# EAGLE schematic room_sensors (EAGLE 6.4)

## Sheet 1 of 6
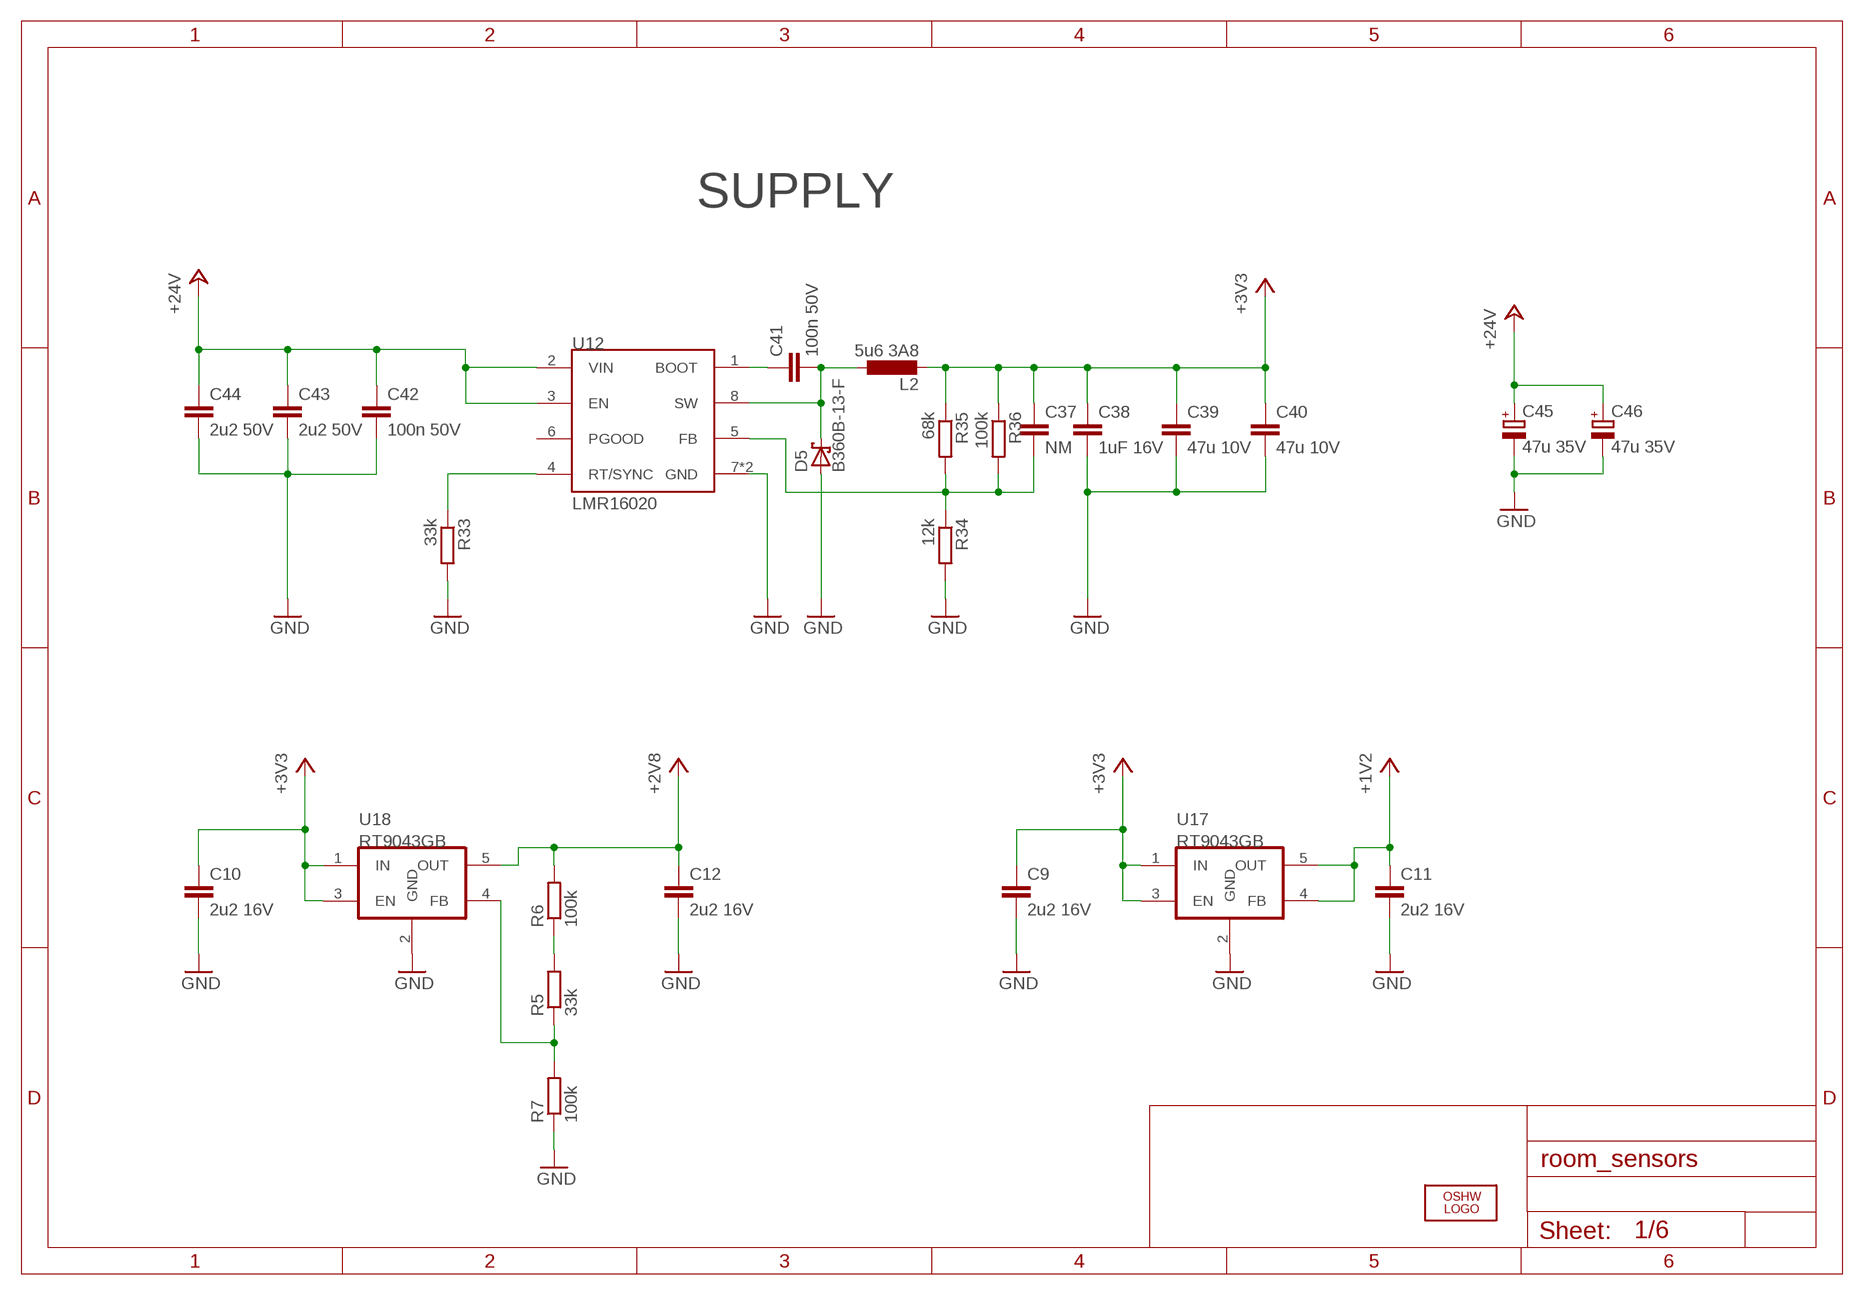
[diagram p0: schematic, sheet 1]

### Parts
C9  2u2 16V  C-EUC1206  [C1206]
C10  2u2 16V  C-EUC1206  [C1206]
C11  2u2 16V  C-EUC1206  [C1206]
C12  2u2 16V  C-EUC1206  [C1206]
C37  NM  C-EUC0805  [C0805]
C38  1uF 16V  C-EUC0805  [C0805]
C39  47u 10V  C-EUC1210  [C1210]
C40  47u 10V  C-EUC1210  [C1210]
C41  100n 50V  C-EUC1206  [C1206]
C42  100n 50V  C-EUC1206  [C1206]
C43  2u2 50V  C-EUC1206  [C1206]
C44  2u2 50V  C-EUC1206  [C1206]
C45  47u 35V  CPOL-EUUD-5X5,8  [UD-5X5,8_NICHICON]
C46  47u 35V  CPOL-EUUD-5X5,8  [UD-5X5,8_NICHICON]
D5  B360B-13-F  MBRS130LT3  [SMB]
L2  5u6 3A8  SLF10145T-150M2R2-PF  [SLF10145T-150M2R2-PF]
LOGO1  OSHW_LOGO_FILLX0350-NT  [OSHW_FILLX350_NOTEXT]
R5  33k  R-EU_R1206  [R1206]
R6  100k  R-EU_R1206  [R1206]
R7  100k  R-EU_R1206  [R1206]
R33  33k  R-EU_R1206  [R1206]
R34  12k  R-EU_R1206  [R1206]
R35  68k  R-EU_R1206  [R1206]
R36  100k  R-EU_R1206  [R1206]
U12  LMR16020  [SOIC127P600X170-8N]
U17  RT9043GB  [SOP95P275X110-5N]
U18  RT9043GB  [SOP95P275X110-5N]

### Nets
+1V2: C11.1 U17.4(FB) U17.5(OUT) ; also sheet 3
+2V8: C12.1 R6.2 U18.5(OUT) ; also sheet 3
+3V3: C9.1 C10.1 C37.1 C38.1 C39.1 C40.1 L2.P$2 R35.1 R36.1 U17.1(IN) U17.3(EN) U18.1(IN) U18.3(EN) ; also sheet 2,3,4,5,6
+24V: C42.1 C43.1 C44.1 C45.+ C46.+ U12.2(VIN) U12.3(EN) ; also sheet 2
ESP32_EN1: R5.1 R7.2 U18.4(FB)
GND: C9.2 C10.2 C11.2 C12.2 C38.2 C39.2 C40.2 C42.2 C43.2 C44.2 C45.- C46.- D5.A R7.1 R33.2 R34.2 U12.7(GND) U12.9(GND) U17.2(GND) U18.2(GND) ; also sheet 2,3,4,5,6
N$4: R5.2 R6.1
N$32: R33.1 U12.4(RT/SYNC)
N$33: C37.2 R34.1 R35.2 R36.2 U12.5(FB)
N$34: C41.2 D5.C L2.P$1 U12.8(SW)
N$35: C41.1 U12.1(BOOT)
Unconnected: U12.6(PGOOD)

### Notes on the sheet
- SUPPLY

## Sheet 2 of 6
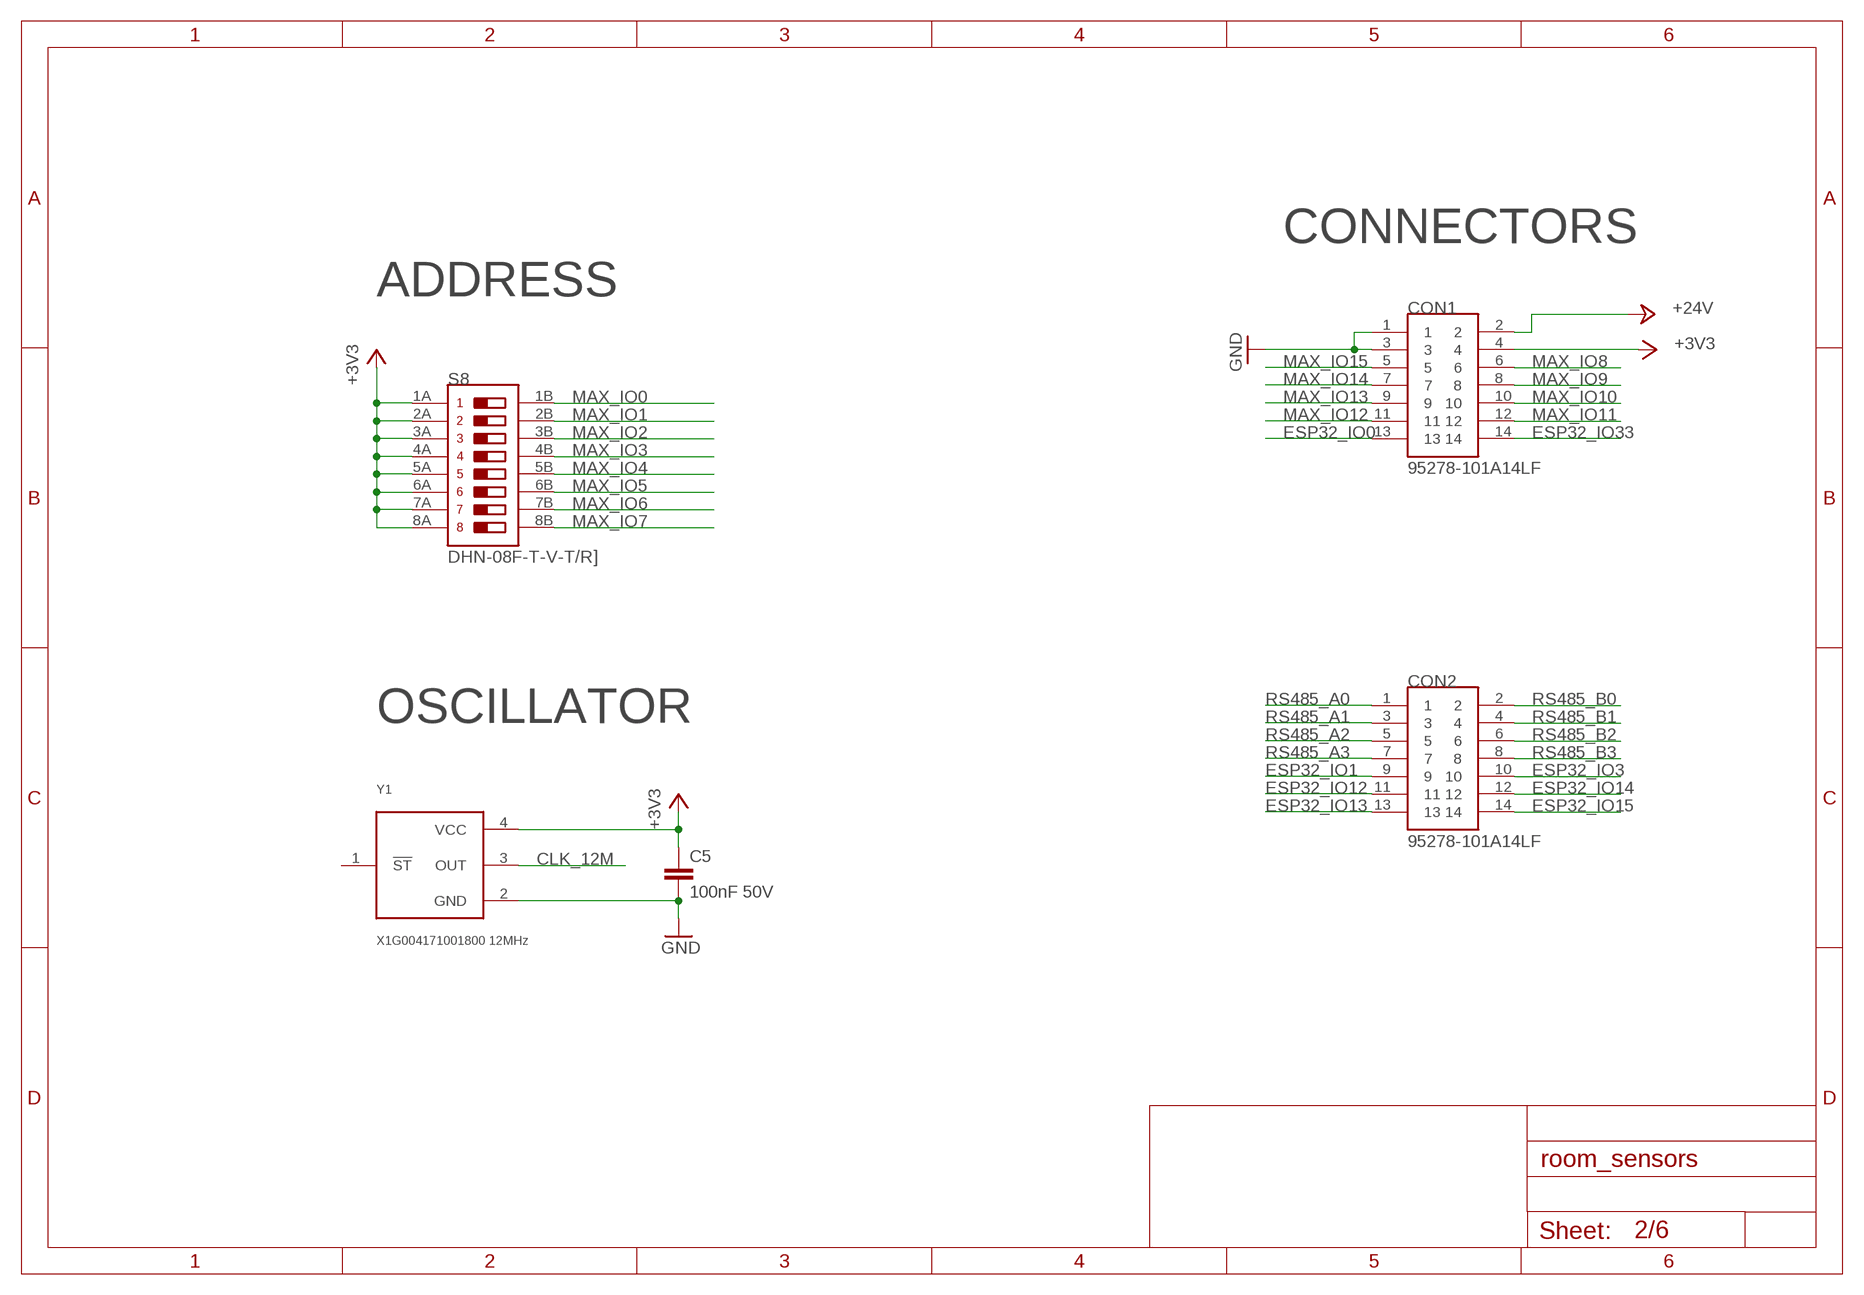
[diagram p1: schematic, sheet 2]

### Parts
C5  100nF 50V  C-EUC0805  [C0805]
CON1  95278-101A14LF  [95278-101A14LF]
CON2  95278-101A14LF  [95278-101A14LF]
S8  DHN-08F-T-V-T/R]  [DHN-08F-T-V-T/R]]
Y1  X1G004171001800 12MHz  X1G0041710033  [OSCCC250X200X80-4N]

### Nets
+3V3: C5.1 CON1.4 S8.1A S8.2A S8.3A S8.4A S8.5A S8.6A S8.7A S8.8A Y1.4(VCC) ; also sheet 1,3,4,5,6
+24V: CON1.2 ; also sheet 1
CLK_12M: Y1.3(OUT) ; also sheet 3,4,5
ESP32_IO0: CON1.13 ; also sheet 3,5,6
ESP32_IO1: CON2.9 ; also sheet 3,5
ESP32_IO3: CON2.10 ; also sheet 3,5
ESP32_IO12: CON2.11 ; also sheet 3
ESP32_IO13: CON2.13 ; also sheet 3
ESP32_IO14: CON2.12 ; also sheet 3
ESP32_IO15: CON2.14 ; also sheet 3
ESP32_IO33: CON1.14 ; also sheet 3,5,6
GND: C5.2 CON1.1 CON1.3 Y1.2(GND) ; also sheet 1,3,4,5,6
MAX_IO0: S8.1B ; also sheet 4
MAX_IO1: S8.2B ; also sheet 4
MAX_IO2: S8.3B ; also sheet 4
MAX_IO3: S8.4B ; also sheet 4
MAX_IO4: S8.5B ; also sheet 4
MAX_IO5: S8.6B ; also sheet 4
MAX_IO6: S8.7B ; also sheet 4
MAX_IO7: S8.8B ; also sheet 4
MAX_IO8: CON1.6 ; also sheet 4
MAX_IO9: CON1.8 ; also sheet 4
MAX_IO10: CON1.10 ; also sheet 4
MAX_IO11: CON1.12 ; also sheet 4
MAX_IO12: CON1.11 ; also sheet 4
MAX_IO13: CON1.9 ; also sheet 4
MAX_IO14: CON1.7 ; also sheet 4
MAX_IO15: CON1.5 ; also sheet 4
RS485_A0: CON2.1 ; also sheet 4
RS485_A1: CON2.3 ; also sheet 4
RS485_A2: CON2.5 ; also sheet 4
RS485_A3: CON2.7 ; also sheet 4
RS485_B0: CON2.2 ; also sheet 4
RS485_B1: CON2.4 ; also sheet 4
RS485_B2: CON2.6 ; also sheet 4
RS485_B3: CON2.8 ; also sheet 4
Unconnected: Y1.1(!ST)

### Notes on the sheet
- CONNECTORS
- ADDRESS
- OSCILLATOR

## Sheet 3 of 6
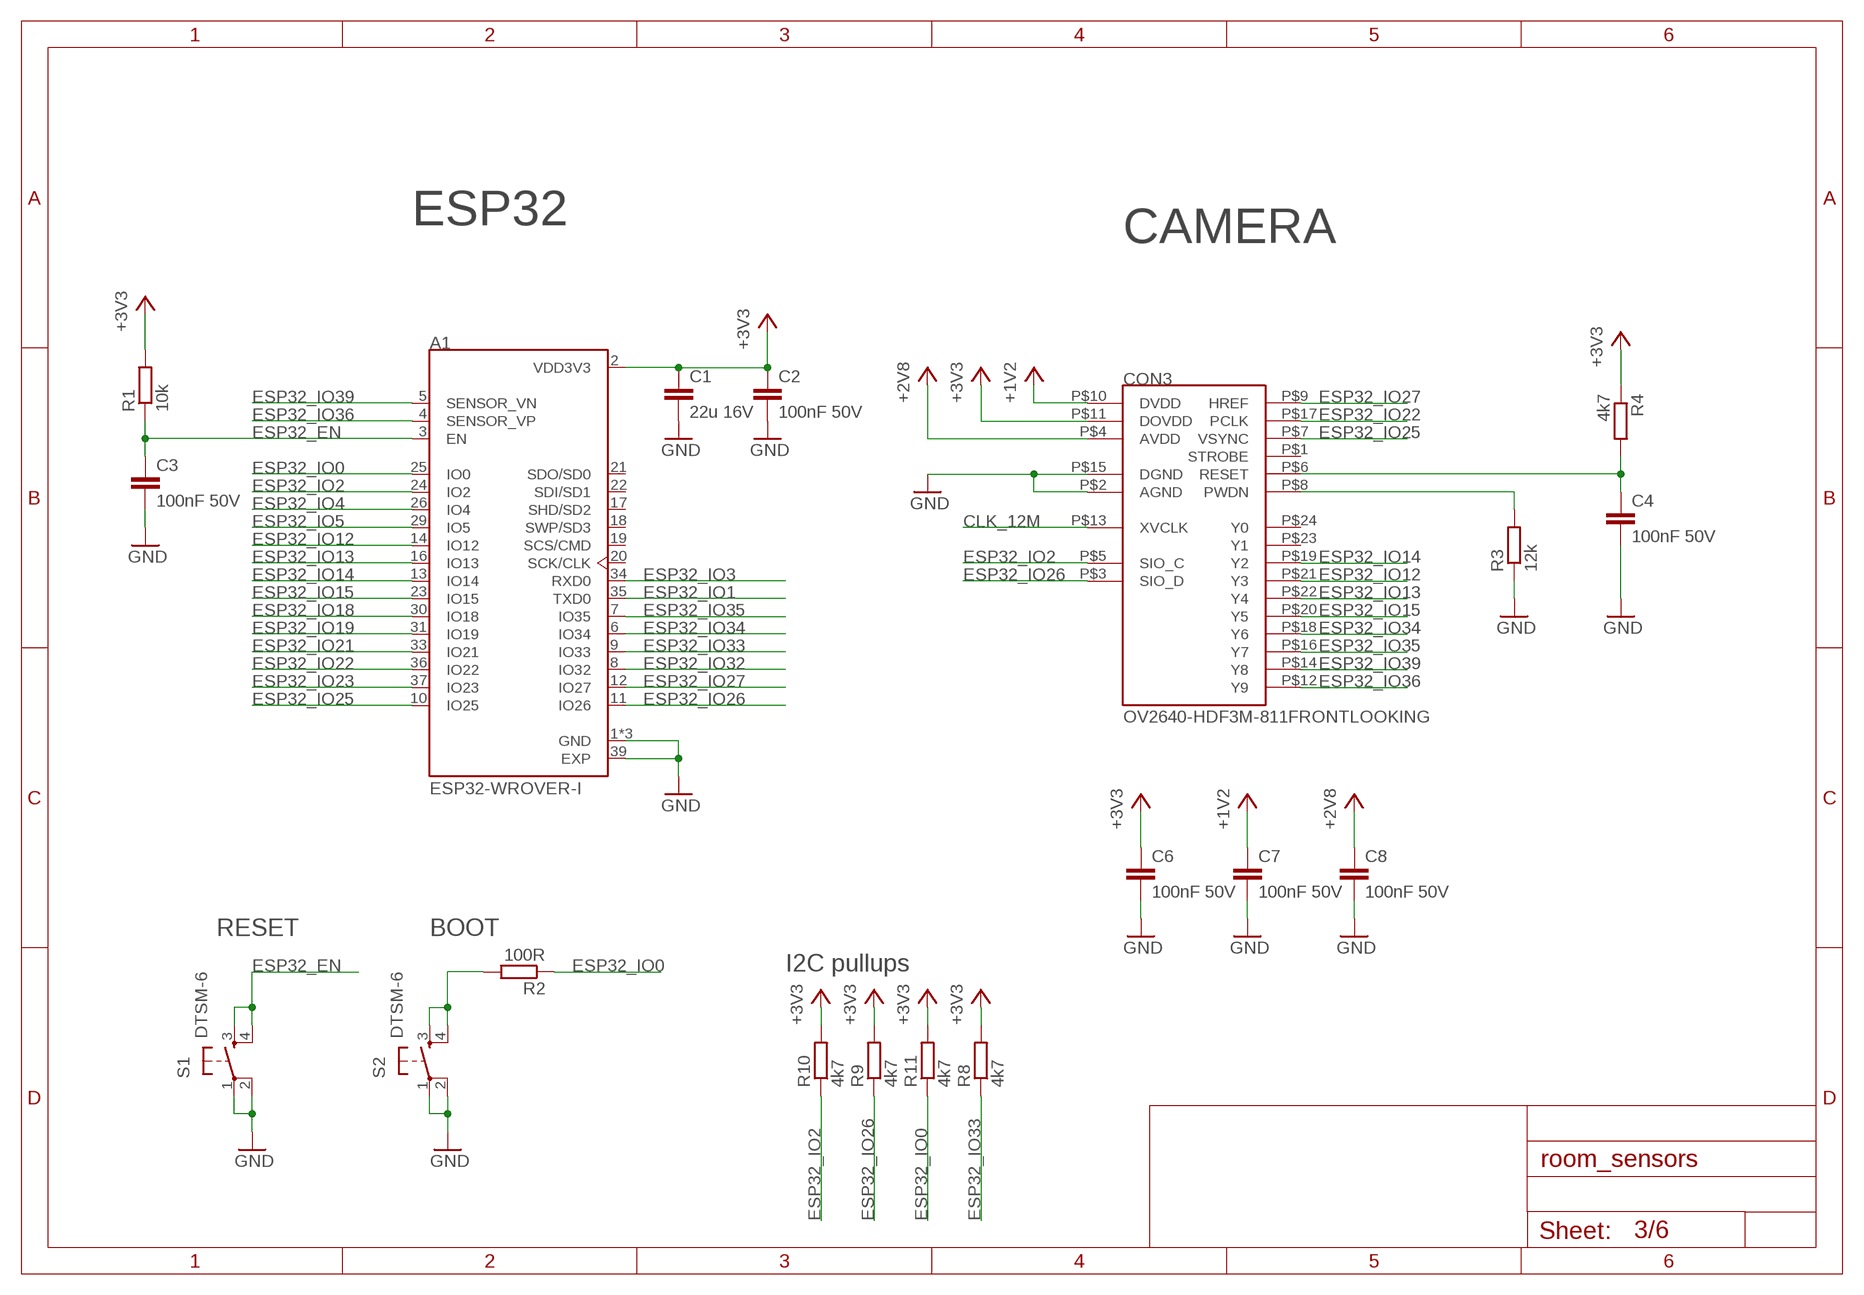
[diagram p2: schematic, sheet 3]

### Parts
A1  ESP32-WROVER-I  [XCVR_ESP32-WROVER-I]
C1  22u 16V  C-EUC1210  [C1210]
C2  100nF 50V  C-EUC0805  [C0805]
C3  100nF 50V  C-EUC0805  [C0805]
C4  100nF 50V  C-EUC0805  [C0805]
C6  100nF 50V  C-EUC0805  [C0805]
C7  100nF 50V  C-EUC0805  [C0805]
C8  100nF 50V  C-EUC0805  [C0805]
CON3  OV2640-HDF3M-811FRONTLOOKING  [FH34SRJ-24S-0.5SH(50)]
R1  10k  R-EU_R1206  [R1206]
R2  100R  R-EU_R1206  [R1206]
R3  12k  R-EU_R1206  [R1206]
R4  4k7  R-EU_R1206  [R1206]
R8  4k7  R-EU_R1206  [R1206]
R9  4k7  R-EU_R1206  [R1206]
R10  4k7  R-EU_R1206  [R1206]
R11  4k7  R-EU_R1206  [R1206]
S1  DTSM-6  [DTSM-6]
S2  DTSM-6  [DTSM-6]

### Nets
+1V2: C7.1 CON3.P$10(DVDD) ; also sheet 1
+2V8: C8.1 CON3.P$4(AVDD) ; also sheet 1
+3V3: A1.2(VDD3V3) C1.1 C2.1 C6.1 CON3.P$11(DOVDD) R1.2 R4.1 R8.2 R9.2 R10.2 R11.2 ; also sheet 1,2,4,5,6
CLK_12M: CON3.P$13(XVCLK) ; also sheet 2,4,5
ESP32_BOOT: R2.2 S2.3 S2.4
ESP32_EN: A1.3(EN) C3.1 R1.1 S1.3 S1.4
ESP32_IO0: A1.25(IO0) R2.1 R11.1 ; also sheet 2,5,6
ESP32_IO1: A1.35(TXD0) ; also sheet 2,5
ESP32_IO2: A1.24(IO2) CON3.P$5(SIO_C) R10.1
ESP32_IO3: A1.34(RXD0) ; also sheet 2,5
ESP32_IO4: A1.26(IO4) ; also sheet 5
ESP32_IO5: A1.29(IO5) ; also sheet 4
ESP32_IO12: A1.14(IO12) CON3.P$21(Y3) ; also sheet 2
ESP32_IO13: A1.16(IO13) CON3.P$22(Y4) ; also sheet 2
ESP32_IO14: A1.13(IO14) CON3.P$19(Y2) ; also sheet 2
ESP32_IO15: A1.23(IO15) CON3.P$20(Y5) ; also sheet 2
ESP32_IO18: A1.30(IO18) ; also sheet 4
ESP32_IO19: A1.31(IO19) ; also sheet 4
ESP32_IO21: A1.33(IO21) ; also sheet 4
ESP32_IO22: A1.36(IO22) CON3.P$17(PCLK)
ESP32_IO23: A1.37(IO23) ; also sheet 4
ESP32_IO25: A1.10(IO25) CON3.P$7(VSYNC)
ESP32_IO26: A1.11(IO26) CON3.P$3(SIO_D) R9.1
ESP32_IO27: A1.12(IO27) CON3.P$9(HREF)
ESP32_IO32: A1.8(IO32) ; also sheet 5
ESP32_IO33: A1.9(IO33) R8.1 ; also sheet 2,5,6
ESP32_IO34: A1.6(IO34) CON3.P$18(Y6)
ESP32_IO35: A1.7(IO35) CON3.P$16(Y7)
ESP32_IO36: A1.4(SENSOR_VP) CON3.P$12(Y9)
ESP32_IO39: A1.5(SENSOR_VN) CON3.P$14(Y8)
GND: A1.1(GND) A1.15(GND) A1.38(GND) A1.39(EXP) C1.2 C2.2 C3.2 C4.2 C6.2 C7.2 C8.2 CON3.P$2(AGND) CON3.P$15(DGND) R3.1 S1.1 S1.2 S2.1 S2.2 ; also sheet 1,2,4,5,6
N$1: CON3.P$8(PWDN) R3.2
N$2: C4.1 CON3.P$6(RESET) R4.2
Unconnected: A1.17(SHD/SD2) A1.18(SWP/SD3) A1.19(SCS/CMD) A1.20(SCK/CLK) A1.21(SDO/SD0) A1.22(SDI/SD1) CON3.P$1(STROBE) CON3.P$23(Y1) CON3.P$24(Y0)

### Notes on the sheet
- ESP32
- CAMERA
- RESET | BOOT
- I2C pullups

## Sheet 4 of 6
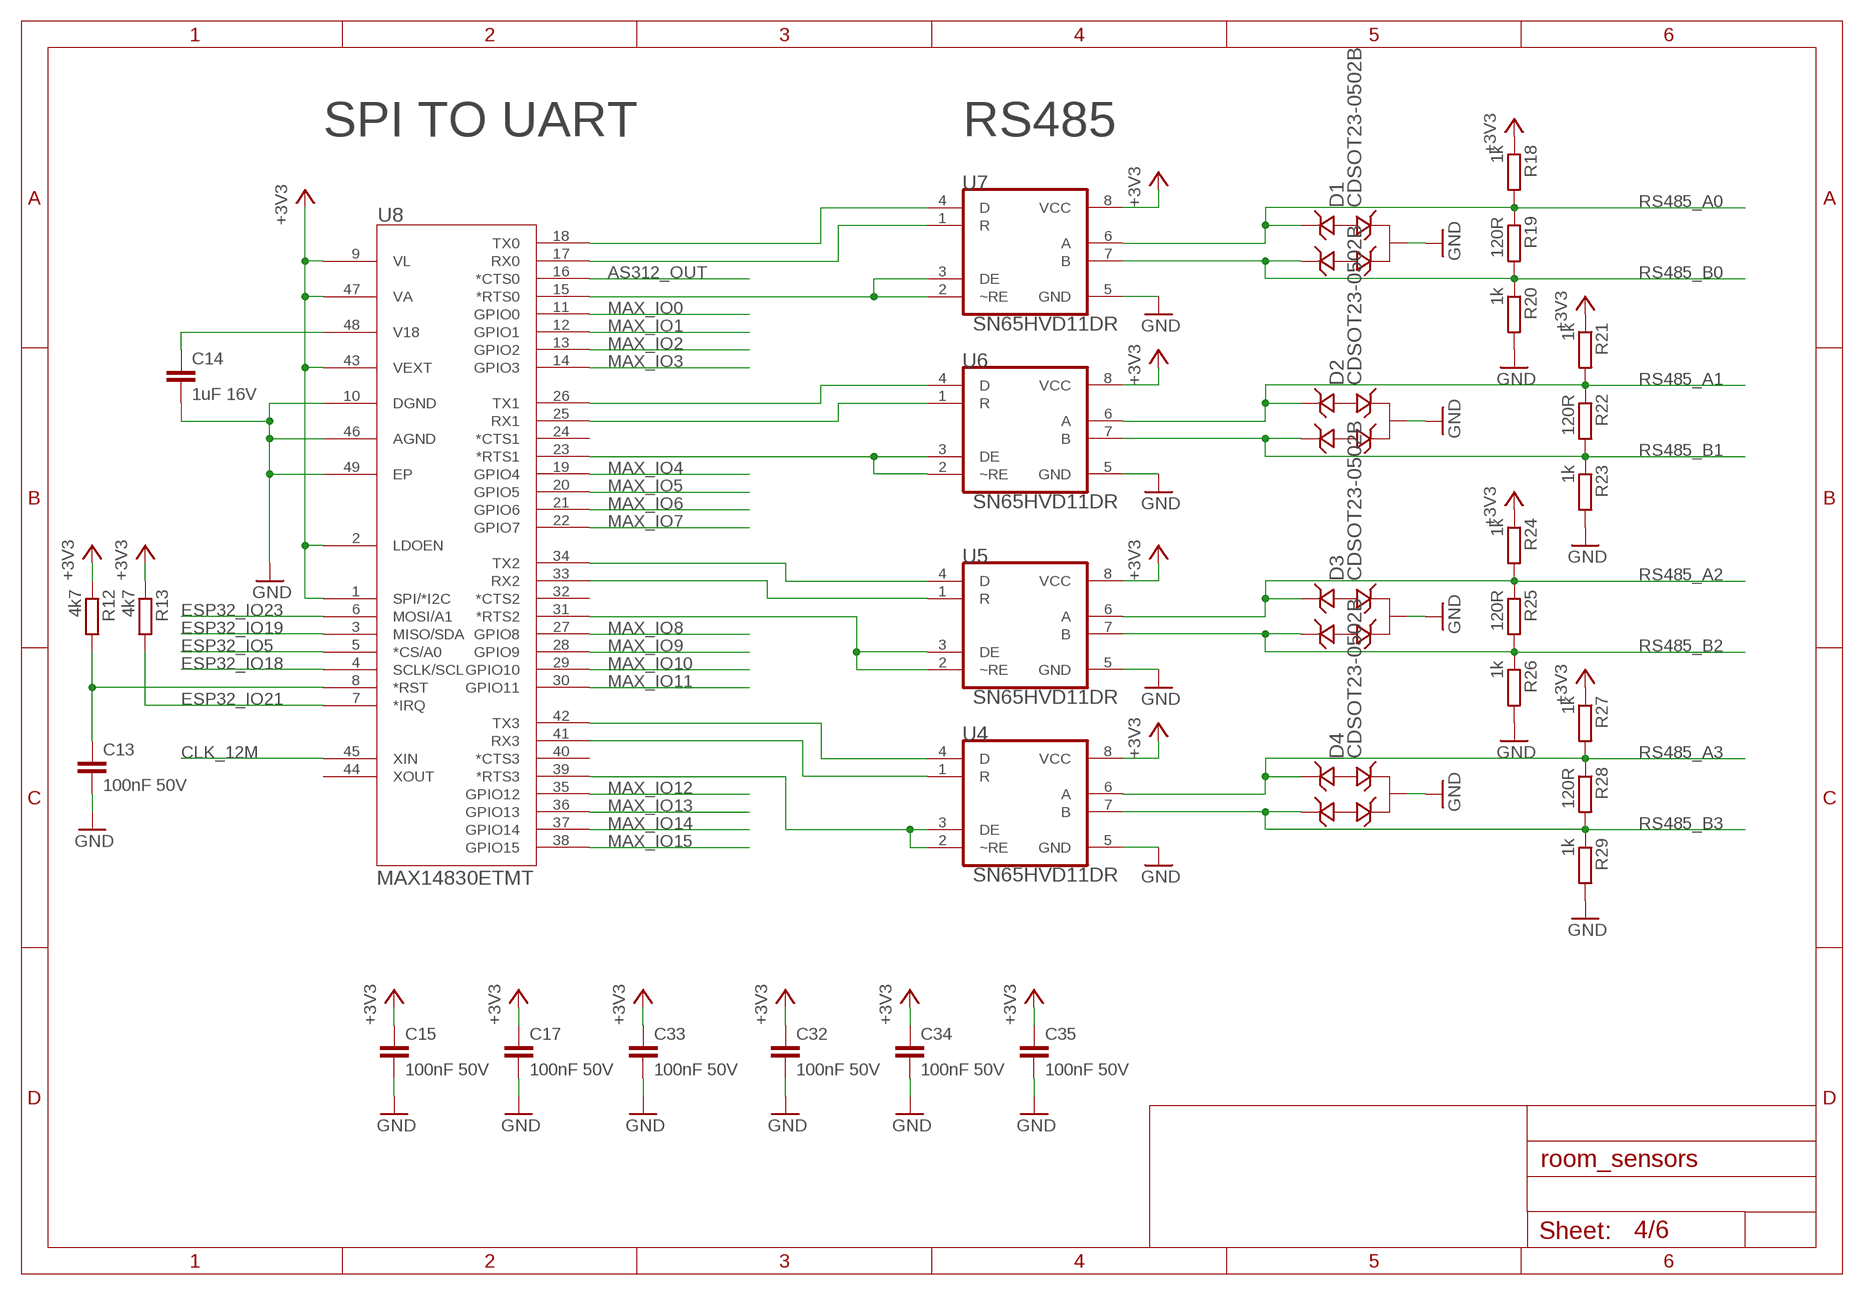
[diagram p3: schematic, sheet 4]

### Parts
C13  100nF 50V  C-EUC0805  [C0805]
C14  1uF 16V  C-EUC0805  [C0805]
C15  100nF 50V  C-EUC0805  [C0805]
C17  100nF 50V  C-EUC0805  [C0805]
C32  100nF 50V  C-EUC0805  [C0805]
C33  100nF 50V  C-EUC0805  [C0805]
C34  100nF 50V  C-EUC0805  [C0805]
C35  100nF 50V  C-EUC0805  [C0805]
D1  CDSOT23-0502B  CDSOT23-SM712  [SOT-23-3]
D2  CDSOT23-0502B  CDSOT23-SM712  [SOT-23-3]
D3  CDSOT23-0502B  CDSOT23-SM712  [SOT-23-3]
D4  CDSOT23-0502B  CDSOT23-SM712  [SOT-23-3]
R12  4k7  R-EU_R1206  [R1206]
R13  4k7  R-EU_R1206  [R1206]
R18  1k  R-EU_R1206  [R1206]
R19  120R  R-EU_R1206  [R1206]
R20  1k  R-EU_R1206  [R1206]
R21  1k  R-EU_R1206  [R1206]
R22  120R  R-EU_R1206  [R1206]
R23  1k  R-EU_R1206  [R1206]
R24  1k  R-EU_R1206  [R1206]
R25  120R  R-EU_R1206  [R1206]
R26  1k  R-EU_R1206  [R1206]
R27  1k  R-EU_R1206  [R1206]
R28  120R  R-EU_R1206  [R1206]
R29  1k  R-EU_R1206  [R1206]
U4  SN65HVD11DR  [SOIC127P600X175-8N]
U5  SN65HVD11DR  [SOIC127P600X175-8N]
U6  SN65HVD11DR  [SOIC127P600X175-8N]
U7  SN65HVD11DR  [SOIC127P600X175-8N]
U8  MAX14830ETMT  [21-0144H_T4877-3]

### Nets
+3V3: C15.1 C17.1 C32.1 C33.1 C34.1 C35.1 R12.1 R13.1 R18.1 R21.1 R24.1 R27.1 U4.8(VCC) U5.8(VCC) U6.8(VCC) U7.8(VCC) U8.1(SPI/*I2C) U8.2(LDOEN) U8.9(VL) U8.43(VEXT) U8.47(VA) ; also sheet 1,2,3,5,6
AS312_OUT: U8.16(*CTS0) ; also sheet 6
CLK_12M: U8.45(XIN) ; also sheet 2,3,5
ESP32_IO5: U8.5(*CS/A0) ; also sheet 3
ESP32_IO18: U8.4(SCLK/SCL) ; also sheet 3
ESP32_IO19: U8.3(MISO/SDA) ; also sheet 3
ESP32_IO21: R13.2 U8.7(*IRQ) ; also sheet 3
ESP32_IO23: U8.6(MOSI/A1) ; also sheet 3
GND: C13.2 C14.2 C15.2 C17.2 C32.2 C33.2 C34.2 C35.2 D1.3(GND) D2.3(GND) D3.3(GND) D4.3(GND) R20.2 R23.2 R26.2 R29.2 U4.5(GND) U5.5(GND) U6.5(GND) U7.5(GND) U8.10(DGND) U8.46(AGND) U8.49(EP) ; also sheet 1,2,3,5,6
MAX_IO0: U8.11(GPIO0) ; also sheet 2
MAX_IO1: U8.12(GPIO1) ; also sheet 2
MAX_IO2: U8.13(GPIO2) ; also sheet 2
MAX_IO3: U8.14(GPIO3) ; also sheet 2
MAX_IO4: U8.19(GPIO4) ; also sheet 2
MAX_IO5: U8.20(GPIO5) ; also sheet 2
MAX_IO6: U8.21(GPIO6) ; also sheet 2
MAX_IO7: U8.22(GPIO7) ; also sheet 2
MAX_IO8: U8.27(GPIO8) ; also sheet 2
MAX_IO9: U8.28(GPIO9) ; also sheet 2
MAX_IO10: U8.29(GPIO10) ; also sheet 2
MAX_IO11: U8.30(GPIO11) ; also sheet 2
MAX_IO12: U8.35(GPIO12) ; also sheet 2
MAX_IO13: U8.36(GPIO13) ; also sheet 2
MAX_IO14: U8.37(GPIO14) ; also sheet 2
MAX_IO15: U8.38(GPIO15) ; also sheet 2
N$3: U7.4(D) U8.18(TX0)
N$5: U7.1(R) U8.17(RX0)
N$6: U6.4(D) U8.26(TX1)
N$7: U6.1(R) U8.25(RX1)
N$8: U5.4(D) U8.34(TX2)
N$9: U5.1(R) U8.33(RX2)
N$10: U4.4(D) U8.42(TX3)
N$11: U4.1(R) U8.41(RX3)
N$12: U7.2(~RE) U7.3(DE) U8.15(*RTS0)
N$13: U6.2(~RE) U6.3(DE) U8.23(*RTS1)
N$14: C13.1 R12.2 U8.8(*RST)
N$15: U5.2(~RE) U5.3(DE) U8.31(*RTS2)
N$16: U4.2(~RE) U4.3(DE) U8.39(*RTS3)
N$17: C14.1 U8.48(V18)
RS485_A0: D1.2(IO2) R18.2 R19.1 U7.6(A) ; also sheet 2
RS485_A1: D2.2(IO2) R21.2 R22.1 U6.6(A) ; also sheet 2
RS485_A2: D3.2(IO2) R24.2 R25.1 U5.6(A) ; also sheet 2
RS485_A3: D4.2(IO2) R27.2 R28.1 U4.6(A) ; also sheet 2
RS485_B0: D1.1(IO1) R19.2 R20.1 U7.7(B) ; also sheet 2
RS485_B1: D2.1(IO1) R22.2 R23.1 U6.7(B) ; also sheet 2
RS485_B2: D3.1(IO1) R25.2 R26.1 U5.7(B) ; also sheet 2
RS485_B3: D4.1(IO1) R28.2 R29.1 U4.7(B) ; also sheet 2
Unconnected: U8.24(*CTS1) U8.32(*CTS2) U8.40(*CTS3) U8.44(XOUT)

### Notes on the sheet
- SPI TO UART | RS485

## Sheet 5 of 6
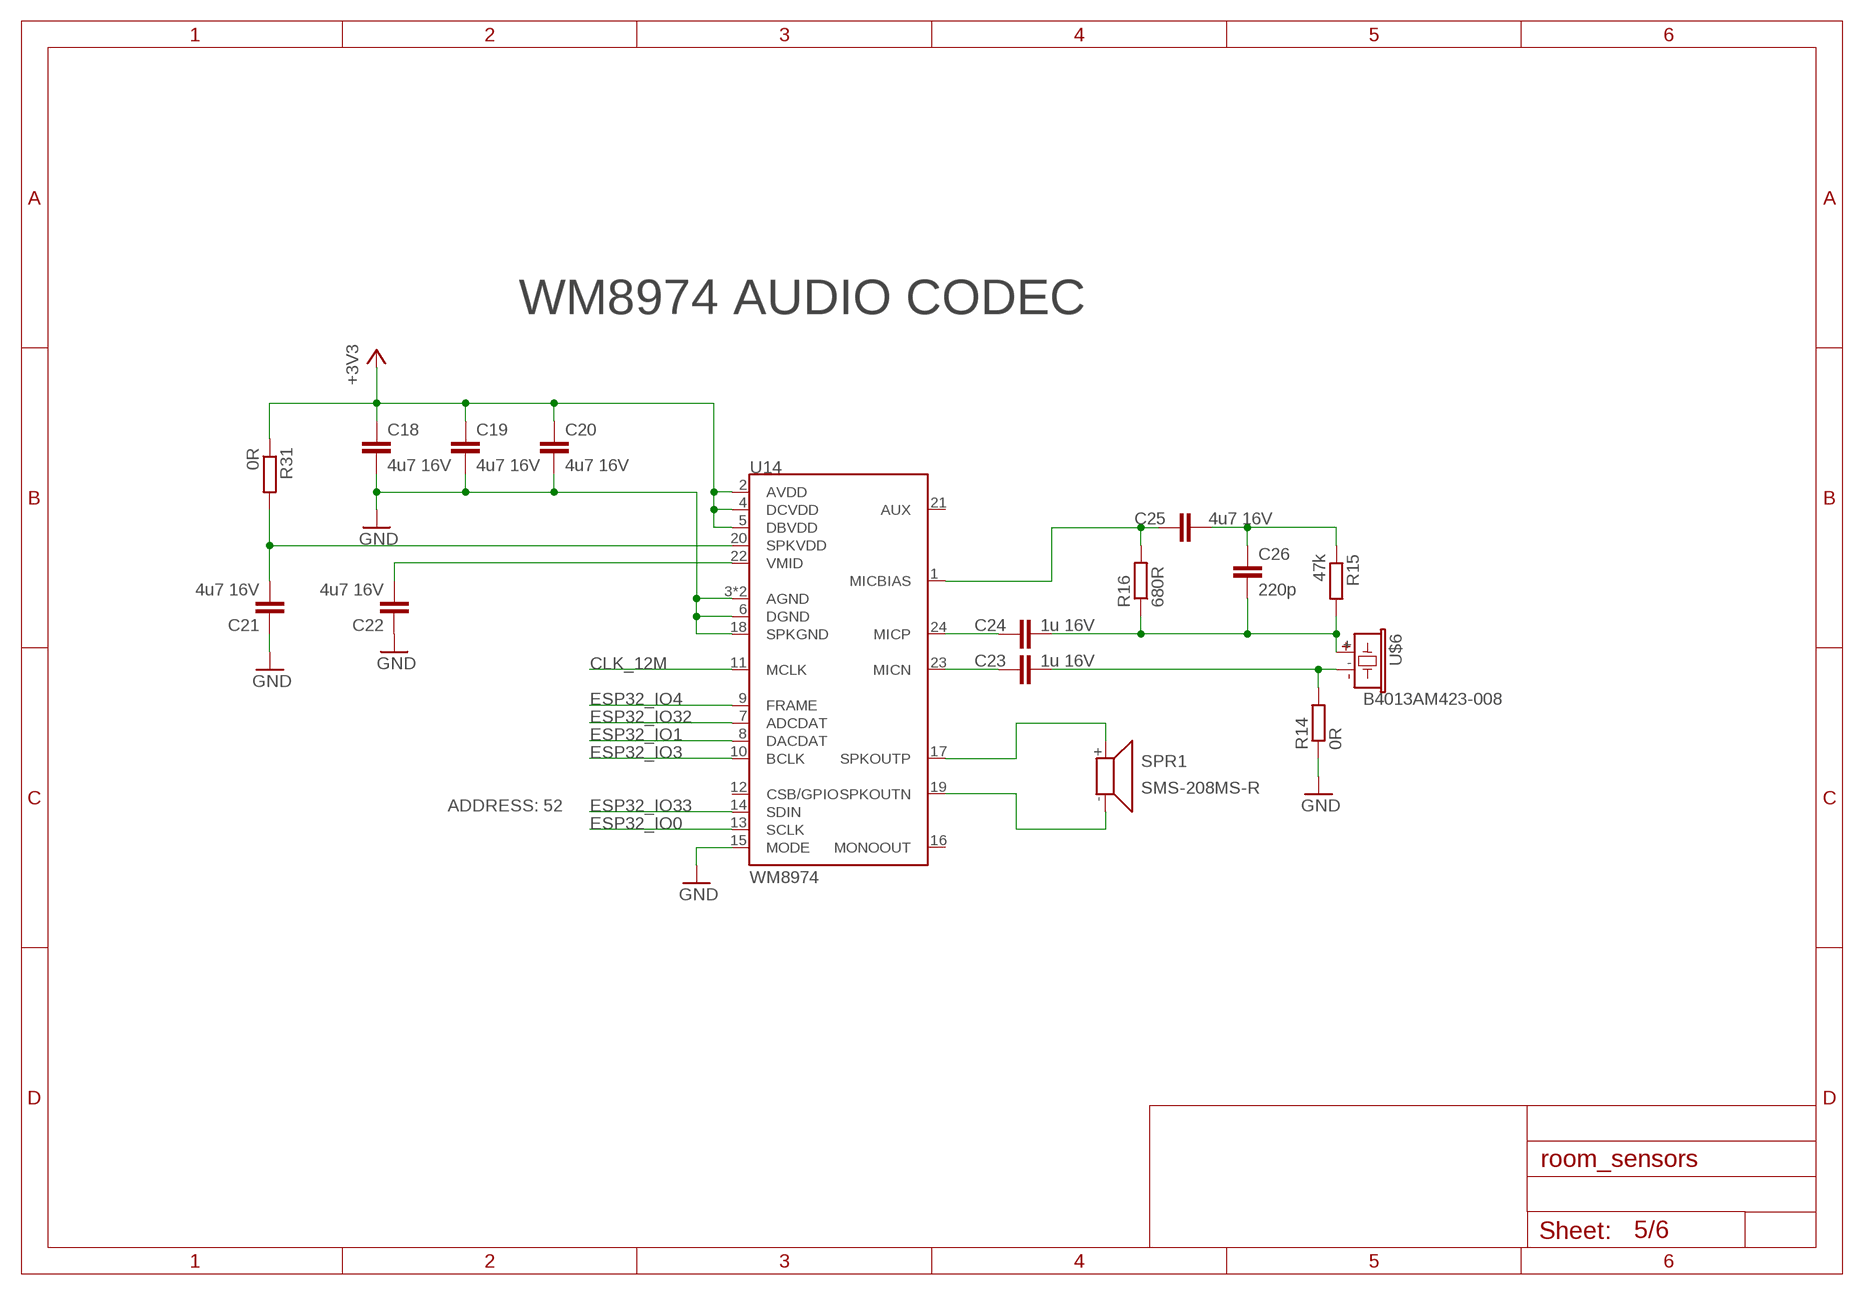
[diagram p4: schematic, sheet 5]

### Parts
C18  4u7 16V  C-EUC0805  [C0805]
C19  4u7 16V  C-EUC0805  [C0805]
C20  4u7 16V  C-EUC0805  [C0805]
C21  4u7 16V  C-EUC0805  [C0805]
C22  4u7 16V  C-EUC0805  [C0805]
C23  1u 16V  C-EUC0805  [C0805]
C24  1u 16V  C-EUC0805  [C0805]
C25  4u7 16V  C-EUC0805  [C0805]
C26  220p  C-EUC0805  [C0805]
R14  0R  R-EU_R1206  [R1206]
R15  47k  R-EU_R1206  [R1206]
R16  680R  R-EU_R1206  [R1206]
R31  0R  R-EU_R0603  [R0603]
SPR1  SMS-208MS-R  [SMS-2008MS-R]
U14  WM8974  [QFN-24_ALT2]
U$6  B4013AM423-008  [MIC]

### Nets
+3V3: C18.1 C19.1 C20.1 R31.1 U14.2(AVDD) U14.4(DCVDD) U14.5(DBVDD) ; also sheet 1,2,3,4,6
CLK_12M: U14.11(MCLK) ; also sheet 2,3,4
ESP32_IO0: U14.13(SCLK) ; also sheet 2,3,6
ESP32_IO1: U14.8(DACDAT) ; also sheet 2,3
ESP32_IO3: U14.10(BCLK) ; also sheet 2,3
ESP32_IO4: U14.9(FRAME) ; also sheet 3
ESP32_IO32: U14.7(ADCDAT) ; also sheet 3
ESP32_IO33: U14.14(SDIN) ; also sheet 2,3,6
GND: C18.2 C19.2 C20.2 C21.1 C22.1 R14.1 U14.3(AGND) U14.6(DGND) U14.15(MODE) U14.18(SPKGND) U14.EP(AGND) ; also sheet 1,2,3,4,6
N$18: C22.2 U14.22(VMID)
N$19: SPR1.+ U14.17(SPKOUTP)
N$20: SPR1.- U14.19(SPKOUTN)
N$21: C23.2 R14.2 U$6.-
N$22: C24.2 C26.2 R15.2 R16.1 U$6.+
N$23: C23.1 U14.23(MICN)
N$24: C24.1 U14.24(MICP)
N$25: C25.1 R16.2 U14.1(MICBIAS)
N$26: C25.2 C26.1 R15.1
N$30: C21.2 R31.2 U14.20(SPKVDD)
Unconnected: U14.12(CSB/GPIO) U14.16(MONOOUT) U14.21(AUX)

### Notes on the sheet
- WM8974 AUDIO CODEC
- ADDRESS: 52

## Sheet 6 of 6
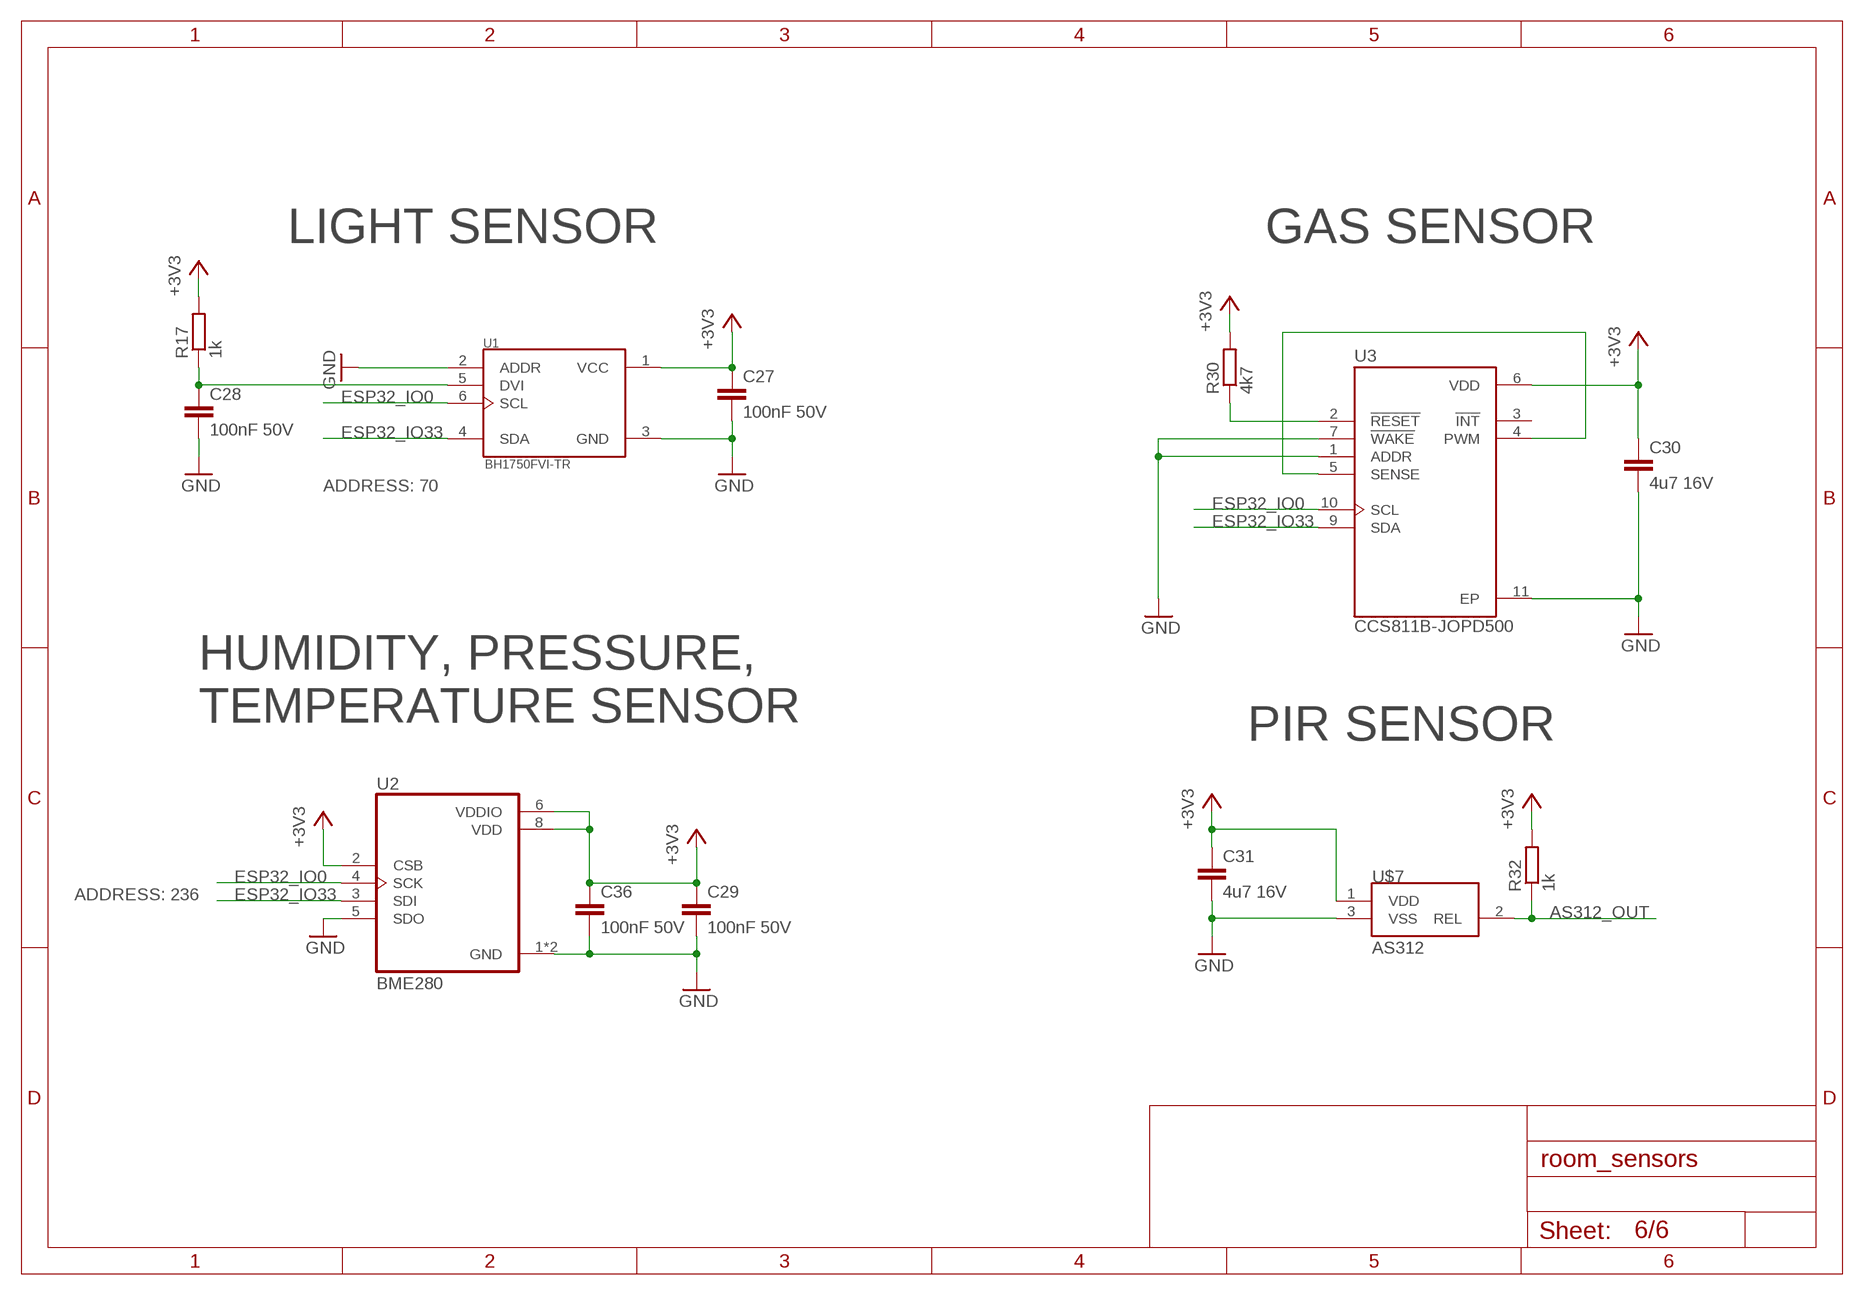
[diagram p5: schematic, sheet 6]

### Parts
C27  100nF 50V  C-EUC0805  [C0805]
C28  100nF 50V  C-EUC0805  [C0805]
C29  100nF 50V  C-EUC0805  [C0805]
C30  4u7 16V  C-EUC0805  [C0805]
C31  4u7 16V  C-EUC0805  [C0805]
C36  100nF 50V  C-EUC0805  [C0805]
R17  1k  R-EU_R1206  [R1206]
R30  4k7  R-EU_R1206  [R1206]
R32  1k  R-EU_R1206  [R1206]
U1  BH1750FVI-TR  [SOTFL50P300X75-6N]
U2  BME280  [PSON65P250X250X100-8N]
U3  CCS811B-JOPD500  [SON60P400X270X110-11N]
U$7  AS312  [TO-39]

### Nets
+3V3: C27.1 C29.1 C30.1 C31.1 C36.1 R17.2 R30.2 R32.2 U1.1(VCC) U2.2(CSB) U2.6(VDDIO) U2.8(VDD) U3.6(VDD) U$7.1(VDD) ; also sheet 1,2,3,4,5
AS312_OUT: R32.1 U$7.2(REL) ; also sheet 4
ESP32_IO0: U1.6(SCL) U2.4(SCK) U3.10(SCL) ; also sheet 2,3,5
ESP32_IO33: U1.4(SDA) U2.3(SDI) U3.9(SDA) ; also sheet 2,3,5
GND: C27.2 C28.2 C29.2 C30.2 C31.2 C36.2 U1.2(ADDR) U1.3(GND) U2.1(GND) U2.5(SDO) U2.7(GND) U3.1(ADDR) U3.7(!WAKE) U3.11(EP) U$7.3(VSS) ; also sheet 1,2,3,4,5
N$27: C28.1 R17.1 U1.5(DVI)
N$28: U3.4(PWM) U3.5(SENSE)
N$29: R30.1 U3.2(!RESET)
Unconnected: U3.3(!INT)

### Notes on the sheet
- LIGHT SENSOR | GAS SENSOR
- ADDRESS: 70
- HUMIDITY, PRESSURE, 
  TEMPERATURE SENSOR
- PIR SENSOR
- ADDRESS: 236

## Library data of the parts
A1 = ESP32-WROVER-I_snapEDA:ESP32-WROVER-I: Module: combo; GPIO, I2C x2, I2S x2, SDIO, SPI x3, UART x3; U.FL; AVAILABILITY: Unavailable; DESCRIPTION: Module: combo; GPIO, I2C x2, I2S x2, SDIO, SPI x3, UART x3; U.FL; MF: Espressif Systems; MP: ESP32-WROVER-I; PACKAGE: Module Espressif Systems; PRICE: None
C1-C15 C17-C44 = rcl:C-EU: CAPACITOR, European symbol
C45 C46 = rcl:CPOL-EU: POLARIZED CAPACITOR, European symbol
CON1 CON2 = 95278-101A14LF_snapEDA:95278-101A14LF
CON3 = parts:OV2640-HDF3M-811
D1-D4 = CDSOT23-SM712_snapEDA:CDSOT23-SM712: Bourns CDSOT23-SM712 http://www.bourns.com/docs/Product-Datasheets/CDSOT23-SM712.pdf TVS Protection Didoe for RS-485 as recommended by TI in their RS-485 Reference Guide: http://www.ti.com/lit/sg/slyt484a/slyt484a.pdf; AVAILABILITY: Unavailable; DESCRIPTION: Diode, Smt Tvs Array, 7vrwm & 12vrwm, Sot23 Package; MF: Bourns; MP: CDSOT23-SM712; PACKAGE: SOT-23 Bourns; PRICE: None
D5 = diode:MBRS130LT3: Schottky Power Rectifier Source: http://www.onsemi.com/pub/Collateral/MBRS130LT3-D.PDF
L2 = parts:SLF10145T-150M2R2-PF
LOGO1 = ohw-logo:OSHW_LOGO_FILL
R1-R36 = rcl:R-EU_: RESISTOR, European symbol
S1 S2 = switch-tact:DTSM-6
S8 = parts:DHN-08F-T-V-T/R]
SPR1 = speaker_snapEDA:SMS-208MS-R
U1 = BH1750FVI-TR_snapEDA:BH1750FVI-TR: Light to Digital Ambient Light Sensor Digital O/P 1lux to 65535lux 6-Pin WSOF Embossed T/R; AVAILABILITY: Unavailable; DESCRIPTION: Light to Digital Ambient Light Sensor Digital O/P 1lux to 65535lux 6-Pin WSOF Embossed T/R; MF: Rohm; MP: BH1750FVI-TR; PACKAGE: SMD-6 Rohm; PRICE: None
U2 = BME280_snapEDA:BME280: DIGITAL HUMIDITY, PRESSURE AND TEMPERATURE SENSOR * Digital interface I²C (up to 3.4 MHz) and SPI (3 and 4 wire, up to 10 MHz)* Supply voltage VDD main supply voltage range: 1.71 V to 3.6 V*VDDIO interface voltage range: 1.2 V to 3.6 V Operating range -40…+85 °C, 0…100 % rel. humidity, 300…1100 hPa The library has been designed by Richard Magdycz <https://www.facebook.com/groups/eaglecadsoftUK>; AVAILABILITY: Unavailable; DESCRIPTION: Integrated pressure, humidity and temperature sensor; 8-pin 2.5x2.5x0.93mm LGA; MF: Bosch; MP: BME280; PACKAGE: LGA-8 Bosch; PRICE: None
U3 = CCS811B-JOPD500_snapEDA:CCS811B-JOPD500: Low Power Digital Sensor For Ind; AVAILABILITY: Unavailable; DESCRIPTION: Low Power Digital Sensor For Ind; MF: ams; MP: CCS811B-JOPD500; PACKAGE: LGA-10 ams; PRICE: None
U4-U7 = SN65HVD11DR_snapEDA:SN65HVD11DR: 3.3-V RS-485 TRANSCEIVERS; AVAILABILITY: Unavailable; DESCRIPTION: RS-485 Interface ICs 3.3V Differential Transceivers; MF: Texas Instruments; MP: SN65HVD11DR; PACKAGE: SOIC-8 Texas Instruments; PRICE: None
U8 = MAX14830ETMT_snapEDA:MAX14830ETMT; AVAILABILITY: Unavailable; DESCRIPTION: UART 4-CH 128Byte FIFO 2.5V/3.3V 48-Pin TQFN EP; MF: Maxim Integrated; MP: MAX14830ETM+; PACKAGE: TQFN-48 Maxim Integrated; PRICE: None
U12 = LMR160X0_snapEDA:LMR16020
U14 = WM8974_snapEDA:WM8974
U17 U18 = NCP551SN_snapEDA:RT9043GB
U$6 = parts:B4013AM423-008
U$7 = parts:AS312
Y1 = X1G0041710033_snapEDA:X1G0041710033: Oscillator, Spxo, Sg-210stf, 25 Mhz, Smd; AVAILABILITY: Unavailable; DESCRIPTION: Oscillator, Spxo, Sg-210stf, 25 Mhz, Smd; MF: EPSON; MP: X1G0041710033; PACKAGE: None; PRICE: None